# EasyEDA schematic echo-dot-4th-gen.json
TITLE: ECHO DOT 4 TO ESP32-WROVER-E; REV: 1.0; Date: 2022-06-26; Sheet: 1/1; Company: Open Source
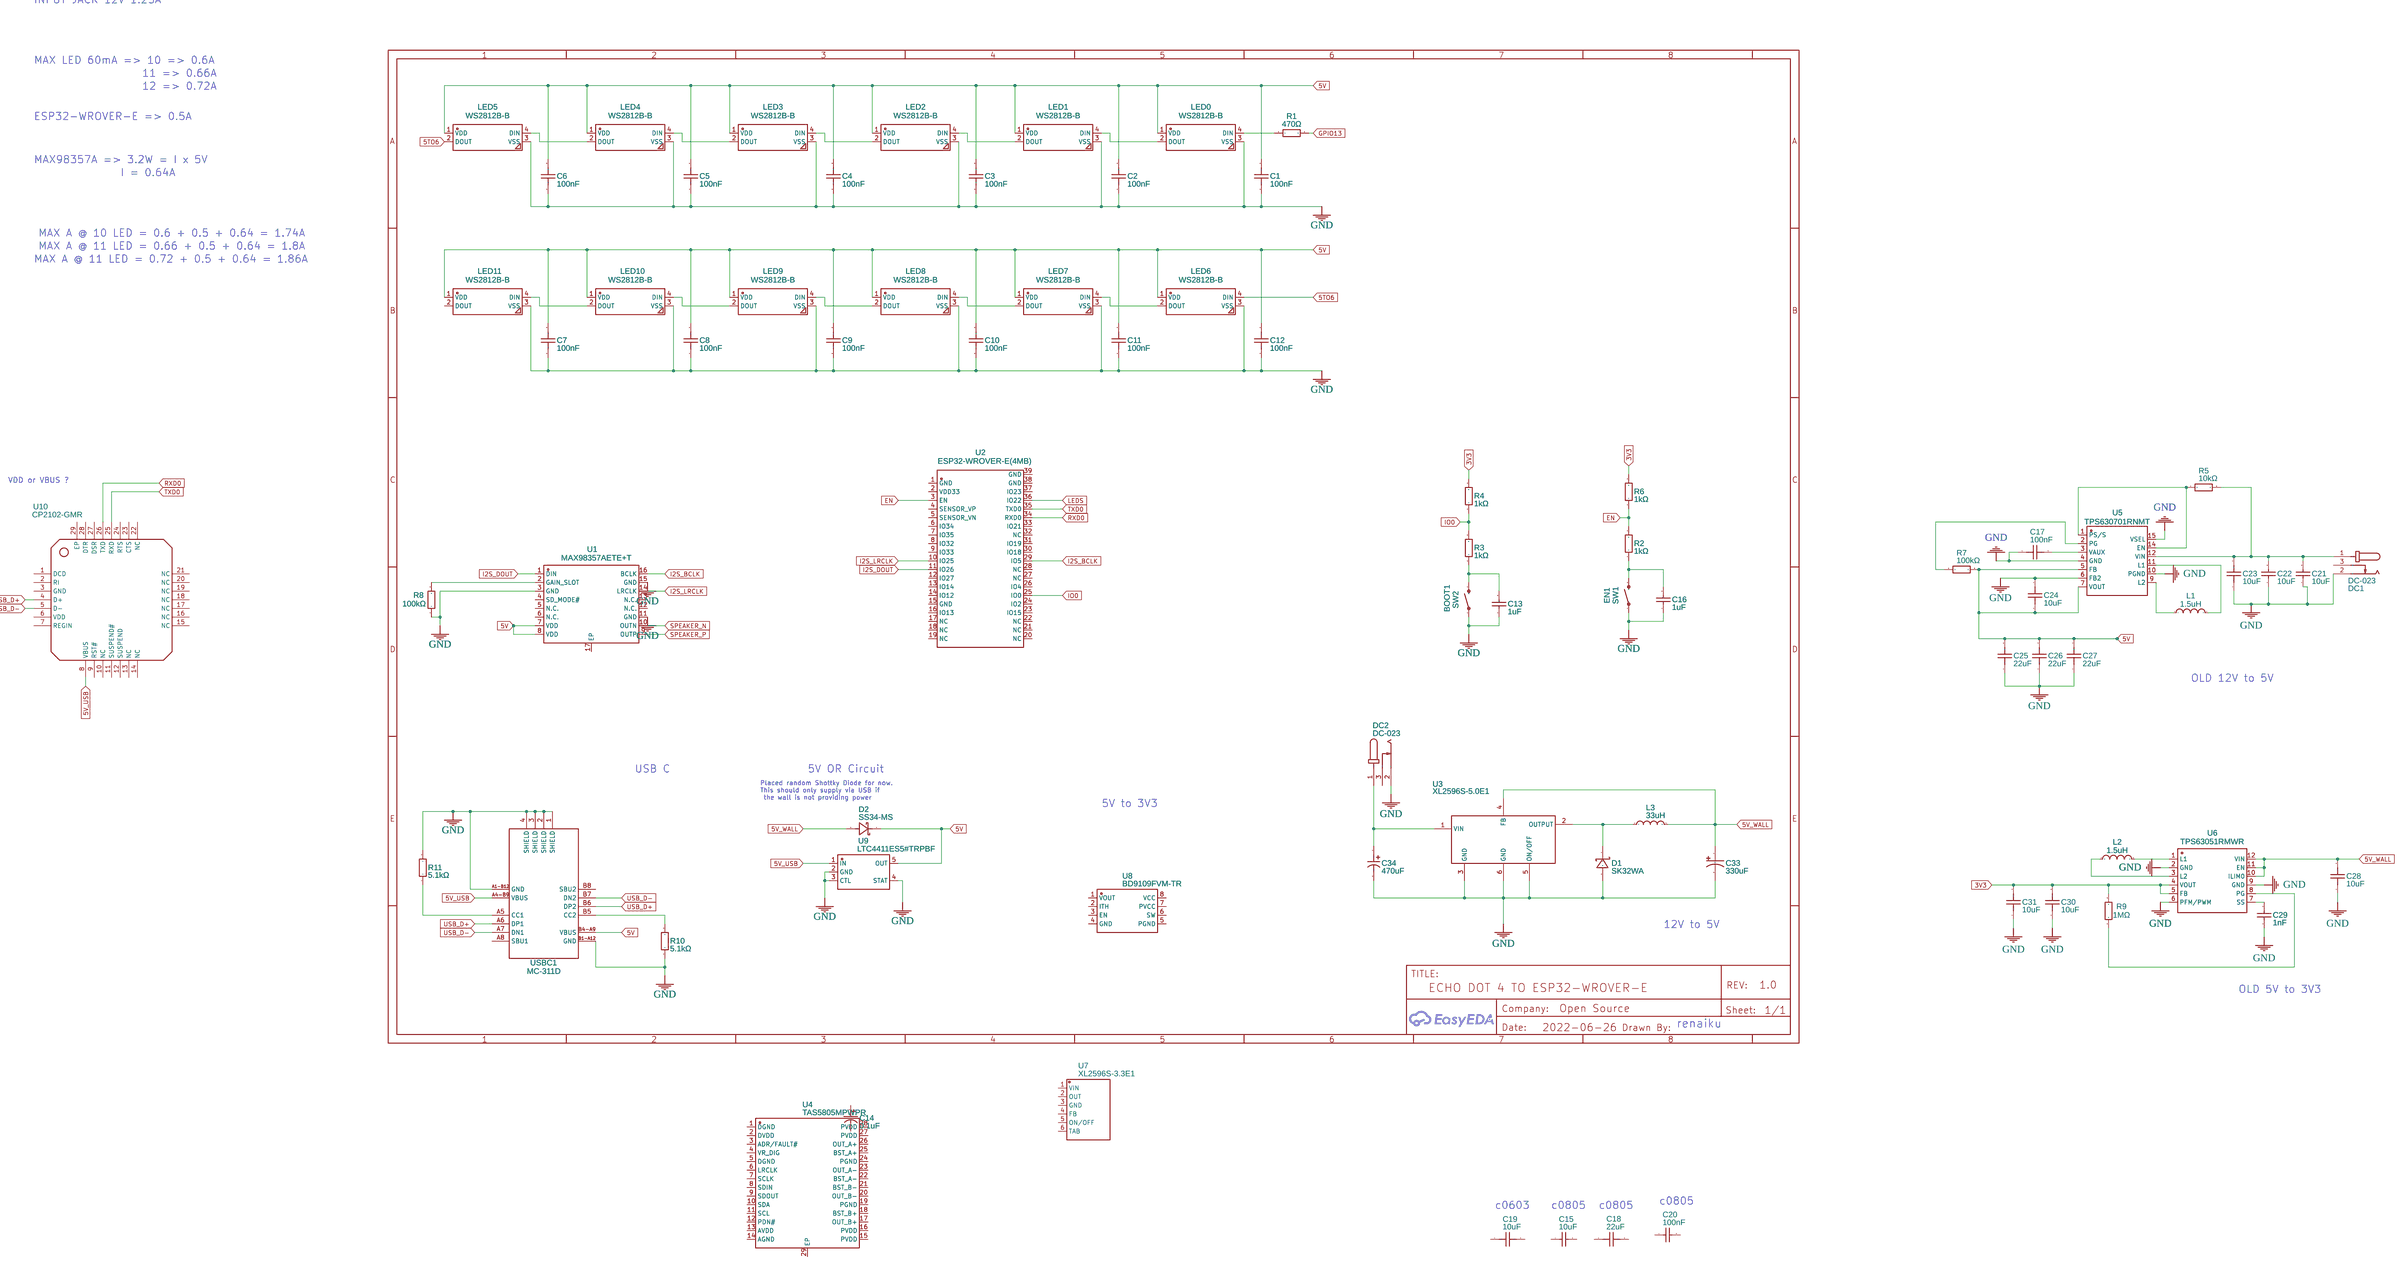
[diagram p0: schematic sheet]

## Parts
BOOT1  SW2  [TACTILE_SWITCH-SMD-RIGHT-ANGLE]
C1  100nF  [C0603]
C2  100nF  [C0603]
C3  100nF  [C0603]
C4  100nF  [C0603]
C5  100nF  [C0603]
C6  100nF  [C0603]
C7  100nF  [C0603]
C8  100nF  [C0603]
C9  100nF  [C0603]
C10  100nF  [C0603]
C11  100nF  [C0603]
C12  100nF  [C0603]
C13  1uF  [C0603]
C14  0.1uF  [CAP-TH_BD4.0-P1.50-D0.8-FD]
C15  10uF  [C0805]
C16  1uF  [C0603]
C17  100nF  [C0603]
C18  22uF  [C0805]
C19  10uF  [C0603]
C20  100nF  [C0805]
C21  10uF  [C0805]
C22  10uF  [C0805]
C23  10uF  [C0603]
C24  10uF  [C0603]
C25  22uF  [C0805]
C26  22uF  [C0805]
C27  22uF  [C0805]
C28  10uF  [C0603]
C29  1nF  [C0603]
C30  10uF  [C0603]
C31  10uF  [C0603]
C33  330uF  [CAP-SMD_BD8.0-L8.3-W8.3-FD]
C34  470uF  [CAP-SMD_BD6.3-L6.6-W6.6-LS7.6-RD]
D1  SK32WA  [SOD-123F_L2.8-W1.8-LS3.7-RD]
D2  SS34-MS  [DO-214AC_L4.3-W2.7-LS5.0-RD]
DC1  DC-023  [DC-IN-TH_DC-023]
DC2  DC-023  [DC-IN-TH_DC-023]
EN1  SW1  [TACTILE_SWITCH-SMD-RIGHT-ANGLE]
L1  1.5uH  [L0603]
L2  1.5uH  [L0603]
L3  33uH  [IND-SMD_L12.3-W12.3]
LED0  WS2812B-B  [LED-SMD_4P-L5.0-W5.0-TL_WS2812B-B]
LED1  WS2812B-B  [LED-SMD_4P-L5.0-W5.0-TL_WS2812B-B]
LED2  WS2812B-B  [LED-SMD_4P-L5.0-W5.0-TL_WS2812B-B]
LED3  WS2812B-B  [LED-SMD_4P-L5.0-W5.0-TL_WS2812B-B]
LED4  WS2812B-B  [LED-SMD_4P-L5.0-W5.0-TL_WS2812B-B]
LED5  WS2812B-B  [LED-SMD_4P-L5.0-W5.0-TL_WS2812B-B]
LED6  WS2812B-B  [LED-SMD_4P-L5.0-W5.0-TL_WS2812B-B]
LED7  WS2812B-B  [LED-SMD_4P-L5.0-W5.0-TL_WS2812B-B]
LED8  WS2812B-B  [LED-SMD_4P-L5.0-W5.0-TL_WS2812B-B]
LED9  WS2812B-B  [LED-SMD_4P-L5.0-W5.0-TL_WS2812B-B]
LED10  WS2812B-B  [LED-SMD_4P-L5.0-W5.0-TL_WS2812B-B]
LED11  WS2812B-B  [LED-SMD_4P-L5.0-W5.0-TL_WS2812B-B]
R1  470Ω  [R0603]
R2  1kΩ  [R0603]
R3  1kΩ  [R0603]
R4  1kΩ  [R0603]
R5  10kΩ  [R0603]
R6  1kΩ  [R0603]
R7  100kΩ  [R0603]
R8  100kΩ  [R0603]
R9  1MΩ  [R0603]
R10  5.1kΩ  [R0603]
R11  5.1kΩ  [R0603]
U1  MAX98357AETE+T  [TQFN-16_L3.0-W3.0-P0.50-BL-EP1.5]
U2  ESP32-WROVER-E(4MB)  [WIFIM-SMD_39P-L31.4-W18.0-P1.27]
U3  XL2596S-5.0E1  [TO-263-5_L10.2-W9.9-P1.70-LS14.4-TL]
U4  TAS5805MPWPR  [HTSSOP-28_L9.7-W4.4-P0.65-LS6.4-BL-EP]
U5  TPS630701RNMT  [VQFN-15_L3.0-W2.5-P0.50-BL]
U6  TPS63051RMWR  [QFN-12_L2.5-W2.5-P0.50-TL]
U7  XL2596S-3.3E1  [TO-263-5_L10.2-W8.6-P1.70-LS14.4-TL]
U8  BD9109FVM-TR  [MSOP-8_L3.0-W3.0-P0.65-LS5.0-BL]
U9  LTC4411ES5#TRPBF  [TSOT-23-5_L2.9-W1.6-P0.95-LS2.8-BL]
U10  CP2102-GMR  [WQFN-28_L5.0-W5.0-P0.50-BL-EP3.2]
USBC1  MC-311D  [USB-C-SMD_MC-311D]

## Library data of the parts
BOOT1 EN1 = -: Various NO switches- pushbuttons, reed, etc; catid: 20; Contributor: SparkFun; Manufacturer Part: ?
C1-C12 = CC0603JRX7R7BB104: Supplier: LCSC; Supplier Part: C109474; Manufacturer: YAGEO; Contributor: LCSC; JLCPCB Part Class: Extended Part
C13 C16 = CC0603KRX5R6BB105: Supplier: LCSC; Manufacturer: YAGEO; Contributor: LCSC; Supplier Part: C106214; JLCPCB Part Class: Extended Part
C14 = 0.1uF 50V 4*7: Supplier: LCSC; Manufacturer: ValuePro; Supplier Part: C45664; JLCPCB Part Class: Extended Part
C15 C21 C22 = CL21A106KAYNNNE: Supplier: LCSC; Manufacturer: SAMSUNG; Supplier Part: C15850; JLCPCB Part Class: Basic Part
C17 = CC0603KRX7R9BB104: Supplier: LCSC; Manufacturer: YAGEO; Supplier Part: C14663; JLCPCB Part Class: Basic Part
C18 C25-C27 = CL21A226MAQNNNE: Supplier: LCSC; Manufacturer: SAMSUNG; Supplier Part: C45783; JLCPCB Part Class: Basic Part
C19 C23 C24 C28 C30 C31 = CL10A106MA8NRNC: Supplier: LCSC; Manufacturer: SAMSUNG; Supplier Part: C96446; JLCPCB Part Class: Basic Part
C20 = CC0805KRX7R9BB104: Supplier: LCSC; Manufacturer: YAGEO; Supplier Part: C49678; JLCPCB Part Class: Basic Part
C29 = CL10B102KB8NNNC: Supplier: LCSC; Manufacturer: SAMSUNG; Supplier Part: C1588; JLCPCB Part Class: Basic Part
C33 = RVT1C331M0810: Supplier: LCSC; Manufacturer: HONOR; Supplier Part: C87872; JLCPCB Part Class: Extended Part
C34 = RVT1C471M0607: Supplier: LCSC; Supplier Part: C2977552; Manufacturer: ROQANG(容强); Contributor: lcsc; JLCPCB Part Class: Extended Part
D1 = SK32WA: Supplier: LCSC; Supplier Part: C183472; Manufacturer: SK; Contributor: LCSC; JLCPCB Part Class: Extended Part
D2 = SS34-MS: Supplier: LCSC; Supplier Part: C2836396; Manufacturer: MSKSEMI(美森科); Contributor: LCSC; JLCPCB Part Class: Extended Part
DC1 DC2 = DC-023: Supplier: LCSC; Supplier Part: C2689666; Manufacturer: XKB Connectivity(中国星坤); Contributor: LCSC; JLCPCB Part Class: Extended Part
L1 L2 = MLF1608A1R5JT000: Supplier: LCSC; Manufacturer: TDK; Supplier Part: C87514; JLCPCB Part Class: Extended Part
L3 = CYH127-33UH: Supplier: LCSC; Supplier Part: C2929502; Manufacturer: SHOU HAN(首韩); Contributor: LCSC; JLCPCB Part Class: Extended Part
LED0-LED11 = WS2812B-B: Supplier: LCSC; Manufacturer: Worldsemi; Contributor: LCSC; Supplier Part: C114586; JLCPCB Part Class: Extended Part
R1 = CR0603FA4700G: Supplier: LCSC; Manufacturer: LIZ; Supplier Part: C101061; Resistance (Ohms): 470; JLCPCB Part Class: Extended Part
R2-R4 R6 = CR0603FA1001G_C126900: Supplier: LCSC; Manufacturer: LIZ; Manufacturer Part: CR0603FA1001G; Supplier Part: C126900; Resistance (Ohms): 1K; JLCPCB Part Class: Extended Part
R5 = 0603WAF1002T5E: Supplier: LCSC; Manufacturer: UniOhm; Supplier Part: C25804; Resistance (Ohms): 10K; JLCPCB Part Class: Basic Part
R7 R8 = 0603WAF1003T5E: Supplier: LCSC; Manufacturer: UniOhm; Supplier Part: C25803; Resistance (Ohms): 100K; JLCPCB Part Class: Basic Part
R9 = 0603WAF1004T5E: Supplier: LCSC; Manufacturer: UniOhm; Supplier Part: C22935; Resistance (Ohms): 1M; JLCPCB Part Class: Basic Part
R10 R11 = 0603WAF5101T5E: Supplier: LCSC; Manufacturer: UniOhm; Supplier Part: C23186; Resistance (Ohms): 5.1K; JLCPCB Part Class: Basic Part
U1 = MAX98357AETE+T: Supplier: LCSC; Supplier Part: C910544; Manufacturer: MAXIM(美信); Contributor: LCSC; JLCPCB Part Class: Extended Part
U2 = ESP32-WROVER-E(4MB): Supplier: LCSC; Supplier Part: C529587; Manufacturer: Espressif Systems; Contributor: LCSC; JLCPCB Part Class: Extended Part
U3 = XL2596S-5.0E1: Supplier: LCSC; Manufacturer: XLSEMI(芯龙); Supplier Part: C74190; JLCPCB Part Class: Extended Part
U4 = TAS5805MPWPR: Supplier: LCSC; Supplier Part: C478472; Manufacturer: Texas Instruments; Contributor: LCSC; JLCPCB Part Class: Extended Part
U5 = TPS630701RNMT: Supplier: LCSC; Manufacturer: TI; Contributor: LCSC; Supplier Part: C181473; JLCPCB Part Class: Extended Part
U6 = TPS63051RMWR: Supplier: LCSC; Manufacturer: TI; Contributor: LCSC; Supplier Part: C139412; JLCPCB Part Class: Extended Part
U7 = XL2596S-3.3E1: Supplier: LCSC; Manufacturer: XLSEMI(芯龙); Supplier Part: C74189; JLCPCB Part Class: Extended Part
U8 = BD9109FVM-TR: Supplier: LCSC; Supplier Part: C308604; Manufacturer: ROHM Semicon; Contributor: LCSC; JLCPCB Part Class: Extended Part
U9 = LTC4411ES5#TRPBF: Supplier: LCSC; Supplier Part: C459901; Manufacturer: Linear Tech; Contributor: LCSC; JLCPCB Part Class: Extended Part
U10 = CP2102-GMR: Supplier: LCSC; Manufacturer: SILICON LABS(芯科); Supplier Part: C6568; JLCPCB Part Class: Basic Part
USBC1 = MC-311D: Supplier: LCSC; Supplier Part: C136423; Manufacturer: SOFNG; Contributor: LCSC; JLCPCB Part Class: Extended Part

## Nets
3V3: C30.2 C31.2 R4.2 R6.2 R9.2 U6.4(VOUT) U6.5(FB)
5V: C1.2 C2.2 C3.2 C4.2 C5.2 C6.2 C7.2 C8.2 C9.2 C10.2 C11.2 C12.2 C24.2 C25.2 C26.2 C27.2 D2.1(A) LED0.1(VDD) LED1.1(VDD) LED2.1(VDD) LED3.1(VDD) LED4.1(VDD) LED5.1(VDD) LED6.1(VDD) LED7.1(VDD) LED8.1(VDD) LED9.1(VDD) LED10.1(VDD) LED11.1(VDD) R7.2 U1.7(VDD) U1.8(VDD) U5.5(FB) U5.7(VOUT) U9.5(OUT) USBC1.B4-A9(VBUS)
5V_USB: U9.1(IN) U10.8(VBUS) USBC1.A4-B9(VBUS)
5V_WALL: C28.2 C33.1 D2.2(K) L3.2 U3.4(FB) U6.10(ILIM0) U6.11(EN) U6.12(VIN)
GND: BOOT1.1 C1.1 C2.1 C3.1 C4.1 C5.1 C6.1 C7.1 C8.1 C9.1 C10.1 C11.1 C12.1 C13.1 C16.1 C17.1 C21.1 C22.1 C23.1 C24.1 C25.1 C26.1 C27.1 C28.1 C29.1 C30.1 C31.1 C33.2 C34.2 D1.2 DC1.2 DC2.2 EN1.1 LED0.3(VSS) LED1.3(VSS) LED2.3(VSS) LED3.3(VSS) LED4.3(VSS) LED5.3(VSS) LED6.3(VSS) LED7.3(VSS) LED8.3(VSS) LED9.3(VSS) LED10.3(VSS) LED11.3(VSS) R8.1 R10.1 R11.2 U1.3(GND) U1.11(GND) U1.15(GND) U3.3(GND) U3.5(ON/OFF) U3.6(GND) U5.4(GND) U5.6(FB2) U5.10(PGND) U5.15(VSEL) U6.2(GND) U6.6(PFM/PWM) U6.9(GND) U9.2(GND) U9.3(CTL) U9.4(STAT) USBC1.1(SHIELD) USBC1.2(SHIELD) USBC1.3(SHIELD) USBC1.4(SHIELD) USBC1.A1-B12(GND) USBC1.B1-A12(GND)
5TO6: LED5.2(DOUT) LED6.4(DIN)
EN: R2.2 R6.1 U2.3(EN)
GPIO13: R1.2
I2S_BCLK: U1.16(BCLK) U2.29(IO5)
I2S_DOUT: U1.1(DIN) U2.11(IO26)
I2S_LRCLK: U1.14(LRCLK) U2.10(IO25)
IO0: R3.2 R4.1 U2.25(IO0)
LEDS: U2.36(IO22)
RXD0: U2.34(RXD0) U10.26(TXD)
SPEAKER_N: U1.10(OUTN)
SPEAKER_P: U1.9(OUTP)
TXD0: U2.35(TXD0) U10.25(RXD)
USB_D+: U10.4(D+) USBC1.A6(DP1) USBC1.B6(DP2)
USB_D-: U10.5(D-) USBC1.A7(DN1) USBC1.B7(DN2)
Net-(BOOT1-2): BOOT1.2 C13.2 R3.1
Net-(C16-2): C16.2 EN1.2 R2.1
Net-(C17-2): C17.2 U5.3(VAUX)
Net-(C21-2): C21.2 C22.2 C23.2 DC1.1 R5.2 U5.12(VIN)
Net-(C29-2): C29.2 U6.7(SS)
Net-(C34-1): C34.1 DC2.1 U3.1(VIN)
Net-(D1-1): D1.1 L3.1 U3.2(OUTPUT)
Net-(L1-1): L1.1 U5.9(L2)
Net-(L1-2): L1.2 U5.11(L1)
Net-(L2-1): L2.1 U6.3(L2)
Net-(L2-2): L2.2 U6.1(L1)
Net-(LED0-2): LED0.2(DOUT) LED1.4(DIN)
Net-(LED0-4): LED0.4(DIN) R1.1
Net-(LED1-2): LED1.2(DOUT) LED2.4(DIN)
Net-(LED2-2): LED2.2(DOUT) LED3.4(DIN)
Net-(LED3-2): LED3.2(DOUT) LED4.4(DIN)
Net-(LED4-2): LED4.2(DOUT) LED5.4(DIN)
Net-(LED6-2): LED6.2(DOUT) LED7.4(DIN)
Net-(LED7-2): LED7.2(DOUT) LED8.4(DIN)
Net-(LED8-2): LED8.2(DOUT) LED9.4(DIN)
Net-(LED9-2): LED9.2(DOUT) LED10.4(DIN)
Net-(LED10-2): LED10.2(DOUT) LED11.4(DIN)
Net-(R5-1): R5.1 U5.1(PS/S) U5.14(EN)
Net-(R7-1): R7.1 U5.2(PG)
Net-(R8-2): R8.2 U1.2(GAIN_SLOT)
Net-(R9-1): R9.1 U6.8(PG)
Net-(R10-2): R10.2 USBC1.B5(CC2)
Net-(R11-1): R11.1 USBC1.A5(CC1)

Not connected (* = marked no-connect by the designer): C14 1 2; C15 1 2; C18 1 2; C19 1 2; C20 1 2; DC1 3; DC2 3; LED11 2(DOUT); U1 4(SD_MODE#) 5(N.C.) 6(N.C.) 12(N.C.) 13(N.C.) 17(EP); U2 1(GND) 2(VDD33) 4(SENSOR_VP) 5(SENSOR_VN) 6(IO34) 7(IO35) 8(IO32) 9(IO33) 12(IO27) 13(IO14) 14(IO12) 15(GND) 16(IO13) 17(NC) 18(NC) 19(NC) 20(NC) 21(NC) 22(NC) 23(IO15) 24(IO2) 26(IO4) 27(NC) 28(NC) 30(IO18) 31(IO19) 32(NC) 33(IO21) 37(IO23) 38(GND) 39(GND); U4 1(DGND) 2(DVDD) 3(ADR/FAULT#) 4(VR_DIG) 5(DGND) 6(LRCLK) 7(SCLK) 8(SDIN) 9(SDOUT) 10(SDA) 11(SCL) 12(PDN#) 13(AVDD) 14(AGND) 15(PVDD) 16(PVDD) 17(OUT_B+) 18(BST_B+) 19(PGND) 20(OUT_B-) 21(BST_B-) 22(BST_A-) 23(OUT_A-) 24(PGND) 25(BST_A+) 26(OUT_A+) 27(PVDD) 28(PVDD) 29(EP); U7 1(VIN) 2(OUT) 3(GND) 4(FB) 5(ON/OFF) 6(TAB); U8 1(VOUT) 2(ITH) 3(EN) 4(GND) 5(PGND) 6(SW) 7(PVCC) 8(VCC); U10 1(DCD) 2(RI) 3(GND) 6(VDD) 7(REGIN) 9(RST#) 10(NC) 11(SUSPEND#) 12(SUSPEND) 13(NC) 14(NC) 15(NC) 16(NC) 17(NC) 18(NC) 19(NC) 20(NC) 21(NC) 22(NC) 23(CTS) 24(RTS) 27(DSR) 28(DTR) 29(EP); USBC1 A8(SBU1) B8(SBU2)

## Notes on the sheet
- INPUT JACK 12V 1.25A
- MAX LED 60mA => 10 => 0.6A
- 11 => 0.66A
- 12 => 0.72A
- ESP32-WROVER-E => 0.5A
- MAX98357A => 3.2W = I x 5V
- I = 0.64A
- MAX A @ 10 LED = 0.6 + 0.5 + 0.64 = 1.74A
- MAX A @ 11 LED = 0.66 + 0.5 + 0.64 = 1.8A
- MAX A @ 11 LED = 0.72 + 0.5 + 0.64 = 1.86A
- VDD or VBUS ?
- OLD 12V to 5V
- USB C
- 5V OR Circuit
- Placed random Shottky Diode for now.
  This should only supply via USB if
   the wall is not providing power
- 5V to 3V3
- 12V to 5V
- OLD 5V to 3V3
- renaiku
- c0805
- c0603
- c0805
- c0805
